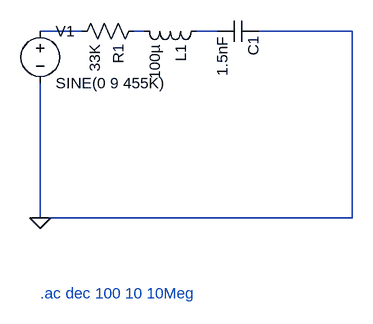
[diagram p0: schematic lc-oscillator.asc]
lc-oscillator.asc, the LTspice schematic file:
Version 4
SHEET 1 880 680
WIRE 192 96 256 96
WIRE 336 96 352 96
WIRE 432 96 464 96
WIRE 528 96 672 96
WIRE 672 96 672 384
WIRE 192 176 192 384
WIRE 192 384 672 384
SYMBOL voltage 192 80 R0
SYMATTR InstName V1
SYMATTR Value SINE(0 9 455K)
SYMBOL res 352 80 R90
SYMATTR InstName R1
SYMATTR Value 33K
SYMBOL ind 448 80 R90
SYMATTR InstName L1
SYMATTR Value 100µ
SYMBOL cap 528 80 R90
SYMATTR InstName C1
SYMATTR Value 1.5nF
FLAG 192 384 0
TEXT 192 500 Left 2 .ac dec 100 10 10Meg

The netlist it stands for:
* lc-oscillator.asc
V1 N001 0 SINE(0 9 455K)
R1 N002 N001 33K
L1 N003 N002 100µ
C1 0 N003 1.5nF
* .ac dec 100 10 10Meg
.backanno
.end